# EAGLE design SWARMESH (EAGLE 9.2.0)
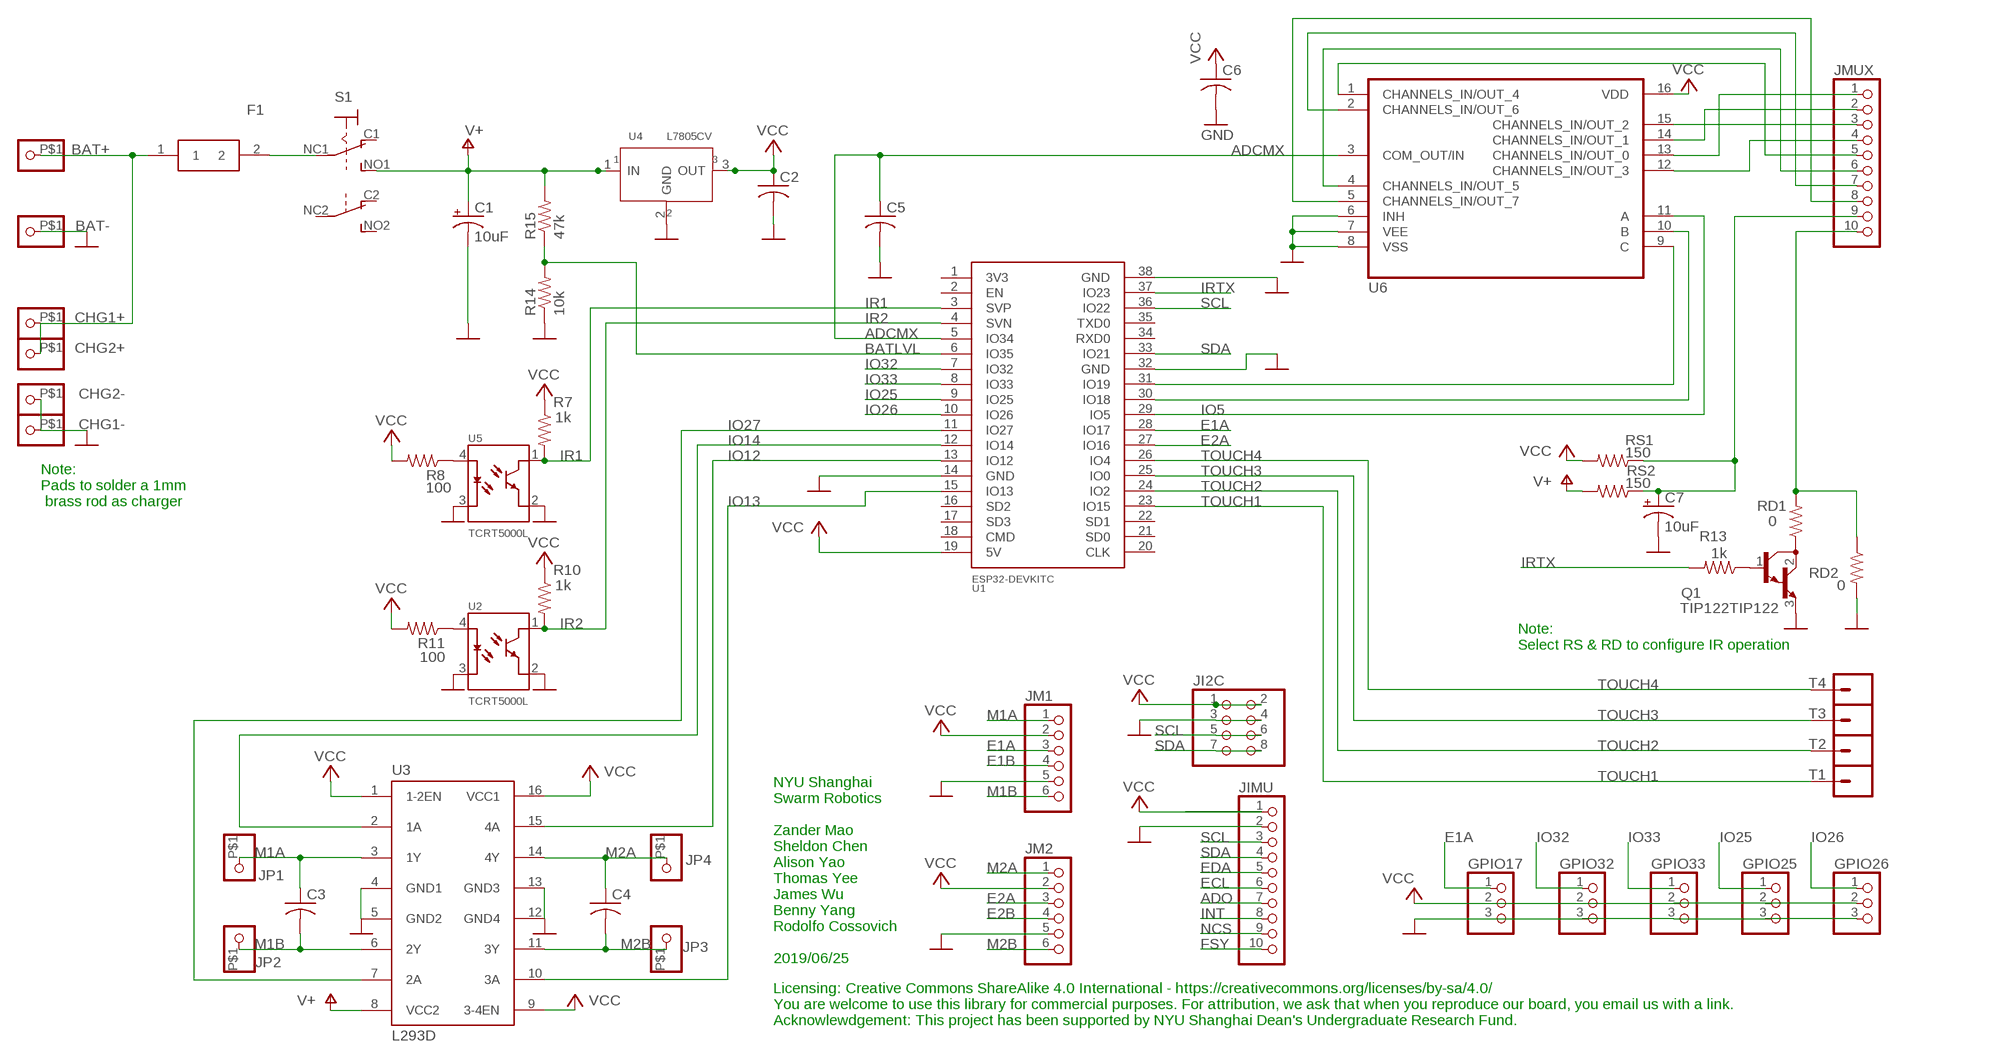
[diagram p0: schematic, sheet 1]

## Parts
BAT+  PINHD-1X1-BIGPOGO  [1X1-BIGPOGO]
BAT-  PINHD-1X1-BIGPOGO  [1X1-BIGPOGO]
C1  10uF  CPOL-USE2.5-7  [E2,5-7]
C2  C-USC0805  [C0805]
C3  C-USC0805  [C0805]
C4  C-USC0805  [C0805]
C5  C-USC0805  [C0805]
C6  C-USC0805  [C0805]
C7  10uF  CPOL-USE2.5-7  [E2,5-7]
CHG1+  PINHD-1X1-BIGPOGO  [1X1-BIGPOGO]
CHG1-  PINHD-1X1-BIGPOGO  [1X1-BIGPOGO]
CHG2+  PINHD-1X1-BIGPOGO  [1X1-BIGPOGO]
CHG2-  PINHD-1X1-BIGPOGO  [1X1-BIGPOGO]
F1  30R400UF  [30R400UF]
GPIO17  PINHD-1X3  [1X03]
GPIO25  PINHD-1X3  [1X03]
GPIO26  PINHD-1X3  [1X03]
GPIO32  PINHD-1X3  [1X03]
GPIO33  PINHD-1X3  [1X03]
JI2C  PINHD-2X4  [2X04]
JIMU  PINHD-1X10  [1X10-BIG]
JM1  PINHD-1X6  [1X06]
JM2  PINHD-1X6  [1X06]
JMUX  PINHD-1X10  [1X10-BIG]
JP1  PINHD-1X1-BIGPOGO  [1X1-BIGPOGO]
JP2  PINHD-1X1-BIGPOGO  [1X1-BIGPOGO]
JP3  PINHD-1X1-BIGPOGO  [1X1-BIGPOGO]
JP4  PINHD-1X1-BIGPOGO  [1X1-BIGPOGO]
Q1  TIP122TIP122  [TIP122MODIFIED]
R7  1k  R-US_M0805  [M0805]
R8  100  R-US_M0805  [M0805]
R10  1k  R-US_M0805  [M0805]
R11  100  R-US_M0805  [M0805]
R13  1k  R-US_M0805  [M0805]
R14  10k  R-US_M0805  [M0805]
R15  47k  R-US_M0805  [M0805]
RD1  0  R-US_M0805  [M0805]
RD2  0  R-US_M0805  [M0805]
RS1  150  R-US_M0805  [M0805]
RS2  150  R-US_M0805  [M0805]
S1  SWITCH_320-938  [PS22F03]
T1  CONN_01SPRING-CONN  [SPRING-CONNECTOR]
T2  CONN_01SPRING-CONN  [SPRING-CONNECTOR]
T3  CONN_01SPRING-CONN  [SPRING-CONNECTOR]
T4  CONN_01SPRING-CONN  [SPRING-CONNECTOR]
U1  ESP32DEVKITC  [ESP32-DEVKITC]
U2  TCRT5000L  [XDCR_TCRT5000L]
U3  L293D  [DIL16]
U4  L7805CV  [L7805CV_FOOTPRINT]
U5  TCRT5000L  [XDCR_TCRT5000L]
U6  CD4051BEE4  [CD4051BEE4DIP]

## Nets
ADCMX: C5.1 U1.5(IO34) U6.3(COM_OUT/IN)
ADO: JIMU.7
BATLVL: R14.2 R15.1 U1.6(IO35)
E1A: GPIO17.1 JM1.3 U1.28(IO17)
E1B: JM1.4
E2A: JM2.3 U1.27(IO16)
E2B: JM2.4
ECL: JIMU.6
EDA: JIMU.5
FSY: JIMU.10
GND: BAT-.P$1 C1.- C2.2 C5.2 C6.2 C7.- CHG1-.P$1 CHG2-.P$1 GPIO17.3 GPIO25.3 GPIO26.3 GPIO32.3 GPIO33.3 JI2C.3 JI2C.4 JIMU.2 JM1.5 JM2.5 Q1.3(E) R14.1 RD2.2 U1.14(GND) U1.32(GND) U1.38(GND) U2.2(E) U2.3(C) U3.4(GND1) U3.5(GND2) U3.12(GND4) U3.13(GND3) U4.2(GND) U5.2(E) U5.3(C)
INT: JIMU.8
IO5: U1.29(IO5) U6.11(A)
IO12: U1.13(IO12) U3.15(4A)
IO13: U1.15(IO13) U3.10(3A)
IO14: U1.12(IO14) U3.2(1A)
IO25: GPIO25.1 U1.9(IO25)
IO26: GPIO26.1 U1.10(IO26)
IO27: U1.11(IO27) U3.7(2A)
IO32: GPIO32.1 U1.7(IO32)
IO33: GPIO33.1 U1.8(IO33)
IR1: R7.2 U1.3(SVP) U5.1(CO)
IR2: R10.2 U1.4(SVN) U2.1(CO)
IRTX: R13.2 U1.37(IO23)
M1A: C3.1 JM1.1 JP1.P$1 U3.3(1Y)
M1B: C3.2 JM1.6 JP2.P$1 U3.6(2Y)
M2A: C4.1 JM2.1 JP4.P$1 U3.14(4Y)
M2B: C4.2 JM2.6 JP3.P$1 U3.11(3Y)
N$1: Q1.2(C) RD1.1
N$5: JMUX.6 U6.4(CHANNELS_IN/OUT_5)
N$7: U1.30(IO18) U6.10(B)
N$8: U1.31(IO19) U6.9(C)
N$9: R11.1 U2.4(A)
N$10: R8.1 U5.4(A)
N$11: JMUX.5 U6.1(CHANNELS_IN/OUT_4)
N$12: Q1.1(B) R13.1 U6.6(INH) U6.7(VEE) U6.8(VSS) ; supply symbol labelled GND
N$13: JMUX.7 U6.2(CHANNELS_IN/OUT_6)
N$14: JMUX.8 U6.5(CHANNELS_IN/OUT_7)
N$15: BAT+.P$1 CHG1+.P$1 CHG2+.P$1 F1.1
N$16: C7.+ JMUX.9 RS1.1 RS2.1
N$17: JMUX.10 RD1.2 RD2.1
N$18: F1.2 S1.NC1(1:P)
N$19: JMUX.1 U6.13(CHANNELS_IN/OUT_0)
N$20: JMUX.2 U6.14(CHANNELS_IN/OUT_1)
N$21: JMUX.4 U6.12(CHANNELS_IN/OUT_3)
N$22: JMUX.3 U6.15(CHANNELS_IN/OUT_2)
NCS: JIMU.9
SCL: JI2C.5 JI2C.6 JIMU.3 U1.36(IO22)
SDA: JI2C.7 JI2C.8 JIMU.4 U1.33(IO21)
TOUCH1: T1.P$2 U1.23(IO15)
TOUCH2: T2.P$2 U1.24(IO2)
TOUCH3: T3.P$2 U1.25(IO0)
TOUCH4: T4.P$2 U1.26(IO4)
V+: C1.+ R15.2 RS2.2 S1.NO1(1:S) U3.8(VCC2) U4.1(IN)
VCC: C2.1 C6.1 GPIO17.2 GPIO25.2 GPIO26.2 GPIO32.2 GPIO33.2 JI2C.1 JI2C.2 JIMU.1 JM1.2 JM2.2 R7.1 R8.2 R10.1 R11.2 RS1.2 U1.19(5V) U3.1(1-2EN) U3.9(3-4EN) U3.16(VCC1) U4.3(OUT) U6.16(VDD)
Unconnected: S1.C1(1:O) S1.C2(B:O) S1.NC2(B:P) S1.NO2(B:S) U1.1(3V3) U1.2(EN) U1.16(SD2) U1.17(SD3) U1.18(CMD) U1.20(CLK) U1.21(SD0) U1.22(SD1) U1.34(RXD0) U1.35(TXD0)

## Notes on the sheet
- Note:
  Pads to solder a 1mm
   brass rod as charger
- Note:
  Select RS & RD to configure IR operation
- NYU Shanghai
  Swarm Robotics
  
  Zander Mao
  Sheldon Chen
  Alison Yao
  Thomas Yee
  James Wu
  Benny Yang
  Rodolfo Cossovich
  
  2019/06/25
- Licensing: Creative Commons ShareAlike 4.0 International - https://creativecommons.org/licenses/by-sa/4.0/ 
  You are welcome to use this library for commercial purposes. For attribution, we ask that when you reproduce our board, you email us with a link.
  Acknowlewdgement: This project has been supported by NYU Shanghai Dean's Undergraduate Research Fund.

## Library data of the parts
BAT+ BAT- CHG1+ CHG1- CHG2+ CHG2- JP1-JP4 = adafruit:PINHD-1X1: Pin header 1x1 for 0.1" spacing With round pins
C1 C7 = adafruit:CPOL-US: POLARIZED CAPACITOR, American symbol
C2-C6 = adafruit:C-US: CAPACITOR, American symbol
F1 = 30R400UF:30R400UF: Littelfuse 4A Resettable Surface Fuse, 30V dc Source: Datasheet <http://m.littelfuse.com/~/media/electronics/datasheets/resettable_ptcs/littelfuse_ptc_30r_datasheet.pdf.pdf>; DESCRIPTION: Littelfuse 4A Resettable Surface Fuse, 30V dc; HEIGHT: 22mm; MANUFACTURER_NAME: LITTELFUSE; MANUFACTURER_PART_NUMBER: 30R400UF; MOUSER_PART_NUMBER: 576-30R400UF; MOUSER_PRICE-STOCK: https://www.mouser.com/Search/Refine.aspx?Keyword=576-30R400UF; RS_PART_NUMBER: 1740842; RS_PRICE-STOCK: http://uk.rs-online.com/web/p/products/1740842
GPIO17 GPIO25 GPIO26 GPIO32 GPIO33 = adafruit:PINHD-1X3: PIN HEADER
JI2C = adafruit:PINHD-2X4: PIN HEADER
JIMU JMUX = adafruit:PINHD-1X10: Pin header 1x10 0.1" spacing With round pins
JM1 JM2 = adafruit:PINHD-1X6: PIN HEADER
Q1 = TIP122(2):TIP122: NPN BIPOLAR DARLINGTON TRANSISTOR
R7 R8 R10 R11 R13-R15 RD1 RD2 RS1 RS2 = adafruit:R-US_: RESISTOR, American symbol
S1 = ArduinoNano LearningBot 4-21-18:SWITCH_320-938: TOGGLE SWITCH distributor RS Components
T1-T4 = SparkFun-Connectors:CONN_01: Single connection point. Often used as Generic Header-pin footprint for 0.1 inch spaced/style header connections On any of the 0.1 inch spaced packages, you can populate with these: Break Away Headers - Straight <https://www.sparkfun.com/products/116> (PRT-00116) Break Away Male Headers - Right Angle <https://www.sparkfun.com/products/553> (PRT-00553) Female Headers <https://www.sparkfun.com/products/115> (PRT-00115) Break Away Headers - Machine Pin <https://www.sparkfun.com/products/117> (PRT-00117) Break Away Female Headers - Swiss Machine Pin <https://www.sparkfun.com/products/743> (PRT-00743) This device is also useful as a general connection point to wire up your design to another part of your project. Our various solder wires solder well into these plated through hole pads. Hook-Up Wire - Assortment (Stranded, 22 AWG) <https://www.sparkfun.com/products/11375> (PRT-11375) Hook-Up Wire - Assortment (Solid Core, 22 AWG) <https://www.sparkfun.com/products/11367> (PRT-11367) View the entire wire category on our website here <https://www.sparkfun.com/categories/141> Special notes: SMTSO-256-ET is a "flush mount" nut for a 4-40 screw. We mostly use this on specialty testbeds; it is a nice way to connect hardware to your PCB at an adjustable hieght. Also note, the SNAP packages are for using a snappable style connector. We sell a baggie of snaps and they are also used on two LilyPad designs: Snap Assortment - 30 pack (male and female) <https://www.sparkfun.com/products/11347> (DEV-11347) LilyPad Arduino SimpleSnap <https://www.sparkfun.com/products/10941> (DEV-10941) LilyPad SimpleSnap Protoboard <https://www.sparkfun.com/products/10940> (DEV-10940); SF_ID: PRT-11822
U1 = ESP32-DEVKITC (1):ESP32DEVKITC
U2 U5 = TCRT5000L:TCRT5000L: TCRT5000 Series 940 nm 100 mA 60 mA Transistor Output Reflective Optical Sensor; AVAILABILITY: Unavailable; DESCRIPTION: TCRT5000 Series 940 nm 100 mA 60 mA Transistor Output Reflective Optical Sensor; MF: Vishay Semiconductor; MP: TCRT5000L; PACKAGE: PCB Mount Vishay; PRICE: None
U3 = st-microelectronics:L293D: PUSH-PULL 4 CHANNEL DRIVER; MPN: L293D; OC_FARNELL: 9589619; OC_NEWARK: 56P8249
U4 = L7805:L7805CV
U6 = CD4051BEE4:CD4051BEE4: Multiplexer 8pin ADC/DAC

## Board
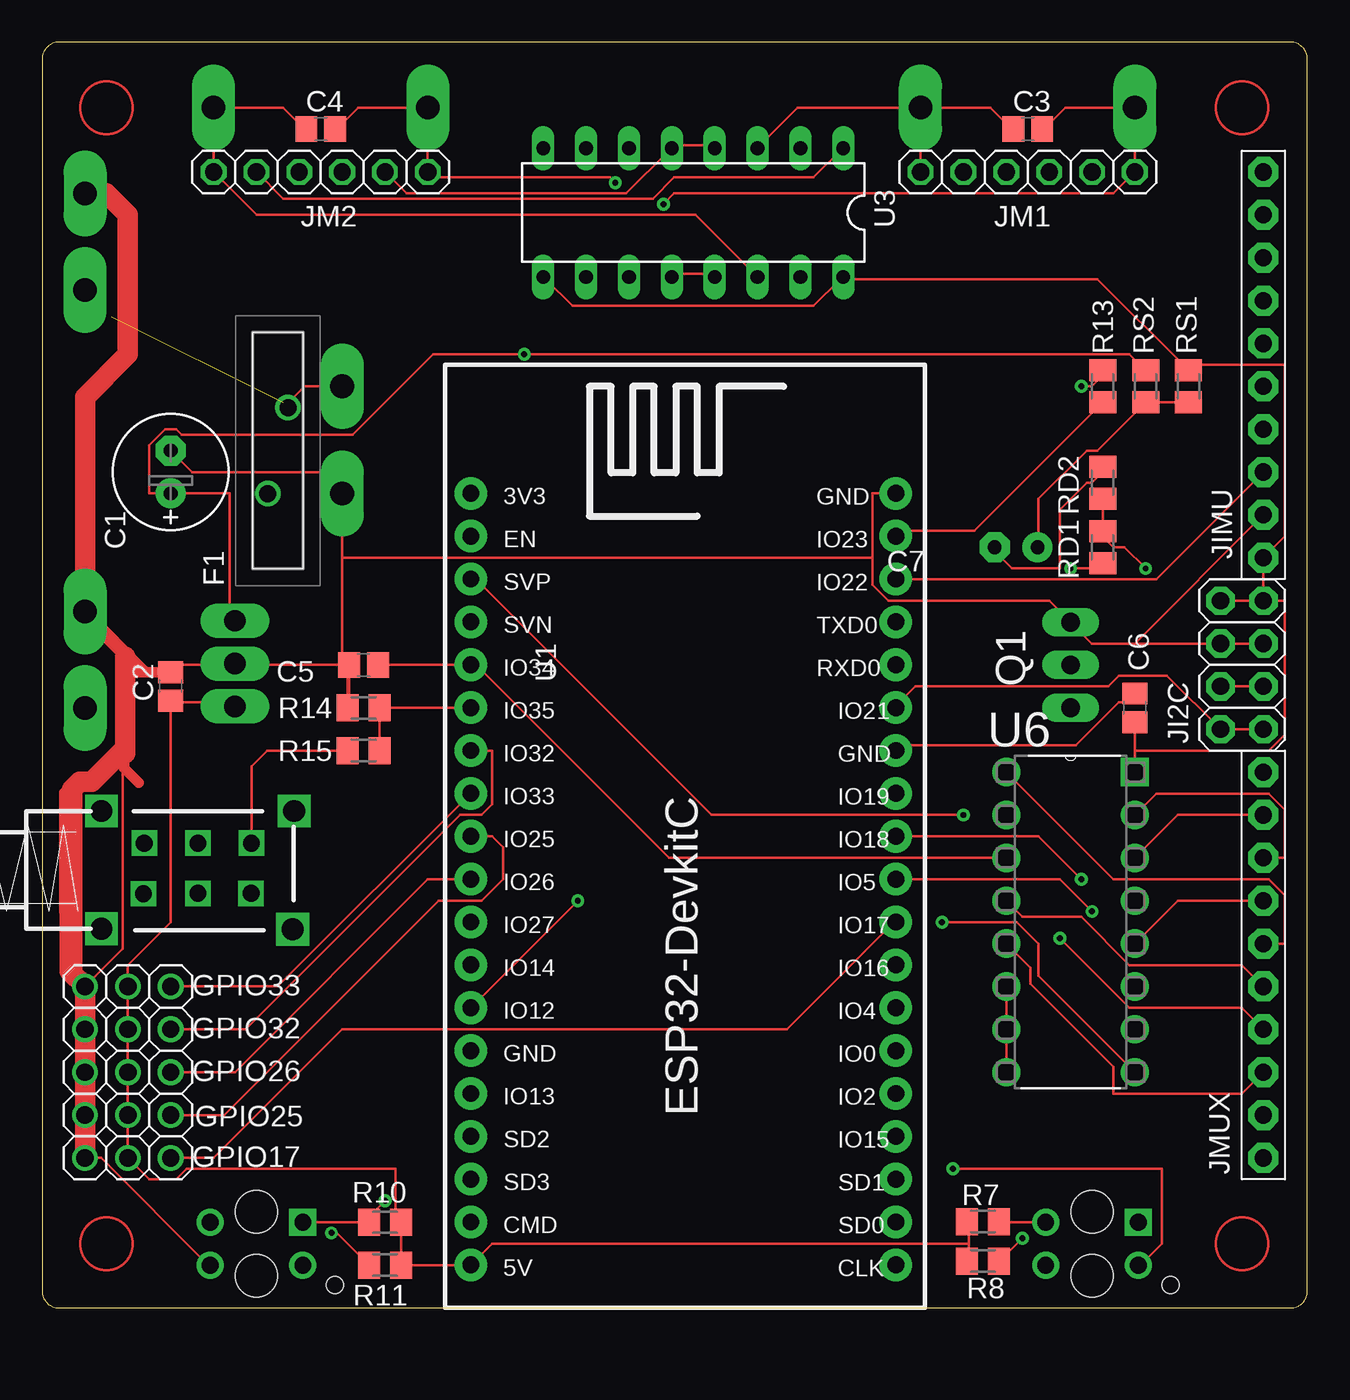
[diagram p1: board, top side]
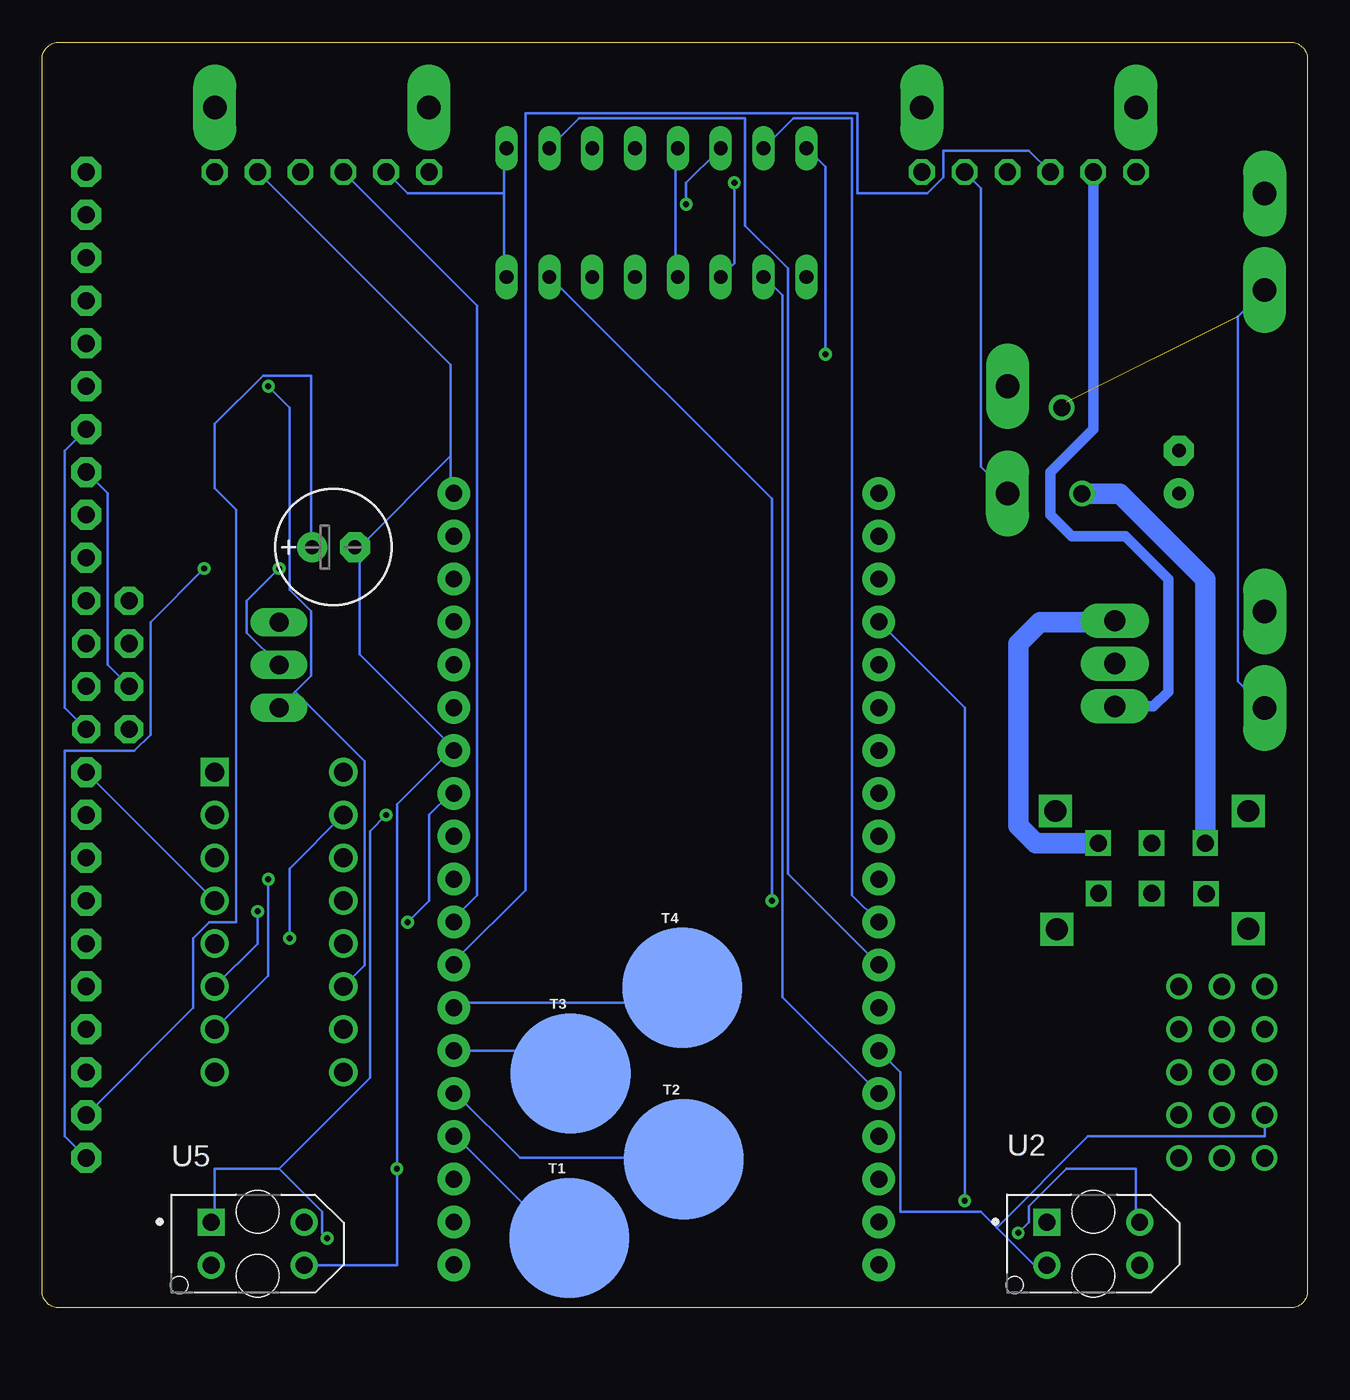
[diagram p2: board, bottom side, seen from below]

Size 75 x 75 mm. Coordinates in mm from the lower left corner, seen from the top.
Outline: 0,74 0,1 arc90 1,0 74,0 arc90 75,1 75,74 arc90 74,75 1,75 arc90 0,74
Copper layers (1*16): Top 0.035mm / dielectric 1.5mm / Bottom 0.035mm
Design rules "default *": minimum track width 6mil, minimum drill 0.35mm, track to track 6mil, track to pad 6mil, pad to pad 6mil, via to via 6mil, smd to smd 6mil, copper to edge 40mil, drill to drill 6mil, minimum pad ring 10mil, minimum via ring 8mil, stop-mask expansion 4mil, vias tented up to drill 0mil, thermal gap 10mil
tKeepout: area 0.9,0.9 to 6.7,6.7; area 68.3,1 to 74,6.6; area 0.9,68.2 to 6.7,74; area 68.2,68.2 to 74,74

### Footprints (pad centres in the part's own frame; a part is rotated, then mirrored left to right if it is on the bottom)
1X1-BIGPOGO = drill 1.4 pad 2.54 long: P$1 0,0
E2,5-7 = drill 0.813 pad 1.778: + -1.27,0 | drill 0.813 pad 1.778 octagon: - 1.27,0
C0805 = smd 1.3 x 1.5: 1 -0.85,0; 2 0.85,0
30R400UF = drill 1.01 pad 1.515: 1 -2.55,0.6; 2 2.55,-0.6
1X03 = drill 1.016: 1 -2.54,0; 2 0,0; 3 2.54,0
2X04 = drill 1.016 pad 1.676 octagon: 1 -3.81,-1.27; 2 -3.81,1.27; 3 -1.27,-1.27; 4 -1.27,1.27; 5 1.27,-1.27; 6 1.27,1.27; 7 3.81,-1.27; 8 3.81,1.27
1X10-BIG = drill 1.016 pad 1.778 octagon: 1 -11.43,0; 2 -8.89,0; 3 -6.35,0; 4 -3.81,0; 5 -1.27,0; 6 1.27,0; 7 3.81,0; 8 6.35,0; 9 8.89,0; 10 11.43,0
1X06 = drill 1.016 octagon: 1 -6.35,0; 2 -3.81,0; 3 -1.27,0; 4 1.27,0; 5 3.81,0; 6 6.35,0
TIP122MODIFIED = drill 1.118 long: 1 -2.54,0; 2 0,0; 3 2.54,0
M0805 = smd 1.3 x 1.6: 1 -0.95,0; 2 0.95,0
PS22F03 = drill 1.3 square: 0 -3.175,5.715; 1 3.835,5.613; 2 3.81,-5.715; 3 -3.175,-5.715 | drill 1 square: C1 -1.27,0; C2 1.702,0; NC1 -1.27,-3.175; NC2 1.727,-3.226; NO1 -1.27,3.175; NO2 1.702,3.15
SPRING-CONNECTOR = smd 7.112 x 7.112: P$2 0,0
ESP32-DEVKITC = drill 1 pad 1.93: 1 -0.01,0.01; 2 2.53,0.01; 3 5.07,0.01; 4 7.61,0.01; 5 10.15,0.01; 6 12.69,0.01; 7 15.23,0.01; 8 17.77,0.01; 9 20.31,0.01; 10 22.85,0.01; 11 25.39,0.01; 12 27.93,0.01; 13 30.47,0.01; 14 33.01,0.01; 15 35.55,0.01; 16 38.09,0.01; 17 40.63,0.01; 18 43.17,0.01; 19 45.71,0.01; 20 45.71,25.2; 21 43.17,25.2; 22 40.63,25.2; 23 38.09,25.2; 24 35.55,25.2; 25 33.01,25.2; 26 30.47,25.2; 27 27.93,25.2; 28 25.39,25.2; 29 22.85,25.2; 30 20.31,25.2; 31 17.77,25.2; 32 15.23,25.2; 33 12.69,25.2; 34 10.15,25.2; 35 7.61,25.2; 36 5.07,25.2; 37 2.53,25.2; 38 -0.01,25.2
XDCR_TCRT5000L = drill 1 pad 1.6 square: 1 -2.75,1.27 | drill 1 pad 1.6: 2 -2.75,-1.27; 3 2.75,-1.27; 4 2.75,1.27 | hole 2.5: 0,1.9; 0,-1.9 | hole 1: -4.65,-2.45
DIL16 = drill 0.813 long: 1 -8.89,-3.81; 2 -6.35,-3.81; 3 -3.81,-3.81; 4 -1.27,-3.81; 5 1.27,-3.81; 6 3.81,-3.81; 7 6.35,-3.81; 8 8.89,-3.81; 9 8.89,3.81; 10 6.35,3.81; 11 3.81,3.81; 12 1.27,3.81; 13 -1.27,3.81; 14 -3.81,3.81; 15 -6.35,3.81; 16 -8.89,3.81
L7805CV_FOOTPRINT = drill 1.27 pad 2.032 long: 1 -2.54,0; 2 0,0; 3 2.54,0
CD4051BEE4DIP = drill 1.118: 1 -3.81,8.89; 2 -3.81,6.35; 3 -3.81,3.81; 4 -3.81,1.27; 5 -3.81,-1.27; 6 -3.81,-3.81; 7 -3.81,-6.35; 8 -3.81,-8.89; 9 3.81,-8.89; 10 3.81,-6.35; 11 3.81,-3.81; 12 3.81,-1.27; 13 3.81,1.27; 14 3.81,3.81; 15 3.81,6.35 | drill 1.118 square: 16 3.81,8.89

### Placement (x,y rotation side)
BAT+  2.54,60.33 90 top
BAT-  17.78,48.26 90 top
C1  7.62,49.53 90 top
C2  7.62,36.83 90 top
C3  58.42,69.85 0 top
C4  16.51,69.85 0 top
C5  19.05,38.1 180 top
C6  64.77,35.56 90 top
C7  57.73,45.08 0 bottom
CHG1+  2.54,35.56 270 top
CHG1-  2.54,41.27 270 top
CHG2+  17.78,54.61 270 bottom
CHG2-  2.54,66.04 270 top
F1  13.97,50.8 270 top
GPIO17  5.08,8.89 180 top
GPIO25  5.08,11.43 180 top
GPIO26  5.08,13.97 180 top
GPIO32  5.08,16.51 180 top
GPIO33  5.08,19.05 180 top
JI2C  71.12,38.1 270 top
JIMU  72.39,55.88 90 top
JM1  58.42,67.31 0 top
JM2  16.51,67.31 0 top
JMUX  72.39,20.32 270 top
JP1  52.07,71.12 90 top
JP2  64.77,71.12 90 top
JP3  22.86,71.12 270 top
JP4  10.16,71.12 90 top
Q1  60.96,38.1 90 top
R7  55.77,2.77 0 top
R8  55.77,5.12 180 top
R10  20.32,5.08 180 top
R11  20.32,2.54 0 top
R13  62.87,54.61 270 top
R14  19.05,35.56 0 top
R15  19.05,33.02 180 top
RD1  62.87,45.09 90 top
RD2  62.87,48.9 90 top
RS1  67.94,54.61 90 top
RS2  65.41,54.61 90 top
S1  9.23,26.27 270 top
T1  43.76,4.16 0 bottom
T2  36.97,8.81 0 bottom
T3  43.69,13.89 0 bottom
T4  37.06,18.98 0 bottom
U1  25.4,48.26 270 top
U2  12.7,3.81 0 bottom
U3  38.59,64.9 180 top
U4  11.42,38.18 270 bottom
U5  62.23,3.81 0 bottom
U6  60.96,22.86 0 top

### Tracks (layer width: path | path; a pad name or v marks a point on that pad's centre or on a via)
ADCMX
  Top 0.152: C5.1 U1.5 25.72,38.1 37.15,26.67 U6.3
BATLVL
  Top 0.152: R14.2 R15.1 | R14.2 U1.6 | R14.2
E1A
  Top 0.152: U1.28 50.48,22.86 44.13,16.51 17.78,16.51 10.16,8.89 GPIO17.1
  Bottom 0.152: JM1.3 49.21,59.37 49.21,24.45 50.48,23.18 U1.28
E2A
  Bottom 0.152: JM2.3 16.51,68.58 21.59,68.58 21.59,66.99 22.54,66.04 26.67,66.04 26.67,70.8 46.35,70.8 46.35,24.77 50.48,20.64 U1.27
GND  (via drill 0.35)
  Top 0.152: C6.2 64.77,36.2 64.45,35.88 63.82,35.88 61.28,33.34 50.8,33.34 U1.32 | v53.98,8.26 66.36,8.26 66.36,3.81 65.09,2.54 U5.2 | JI2C.4 JI2C.3 64.77,39.37 | 64.77,39.37 62.23,39.37 Q1.3 59.69,41.91 50.16,41.91 49.21,42.86 49.21,44.45 | 64.77,39.37 JIMU.2 | RD2.2 62.87,49.53 62.23,48.9 61.91,48.9 60.33,47.31 60.33,43.81 57.47,43.81 56.52,44.77 C7.- | 49.21,44.45 49.21,48.26 50.48,48.26 U1.38 | U2.3 9.84,2.54 3.49,8.89 GPIO17.3 GPIO25.3 GPIO26.3 GPIO32.3 GPIO33.3 4.76,21.27 4.76,33.02 4.76,37.78 | U3.12 37.47,61.28 39.69,61.28 U3.13 | U3.4 39.69,68.9 37.47,68.9 U3.5 37.15,68.58 34.61,66.04 21.59,66.04 JM2.5 | 7.62,37.78 7.94,38.1 11.11,38.1 U4.2 11.43,38.1 17.78,38.1 | CHG1-.P$1 4.76,39.05 4.76,37.78 | 7.62,37.78 5.71,37.78 4.76,37.78 | 7.62,37.78 C2.2 | C1.- 8.89,49.53 16.51,49.53 BAT-.P$1 17.78,44.45 | 17.78,44.45 17.78,38.1 | 18.1,38.1 C5.2 | 17.78,44.45 49.21,44.45 | 17.78,38.1 18.1,37.78 R14.1 18.2,35.66 C5.2 | C5.2 17.78,38.1
  Top 0.61: 5.71,37.78 4.92,38.58 2.54,40.96 CHG1-.P$1 6.13,37.68 | 6.13,37.68 4.87,37.68 4.87,31.96 5.71,31.11 | 6.13,37.68 C2.2 | 4.92,32.86 3.17,31.11 1.91,31.11 1.32,30.53 1.32,23.5
  Top 1.219: GPIO17.3 GPIO33.3 1.63,19.96 | 1.63,19.96 1.63,23.5 | 1.63,19.96 1.78,20.12 1.78,30.74 2.22,31.18 2.92,31.18 4.76,33.02 | 4.92,32.86 4.92,38.58 | CHG1-.P$1 2.54,53.98 5.08,56.52 5.08,64.77 3.81,66.04 CHG2-.P$1
  Bottom 0.152: U5.3 53.98,2.54 v53.98,8.26 53.98,29.84 50.8,33.02 U1.32 50.8,33.34 56.2,38.73 56.2,44.77 C7.- 56.2,45.09 50.8,50.48 | JM1.5 50.8,55.88 50.8,50.48 | 50.8,50.48 50.8,48.58 U1.38 | U2.2 16.19,2.54 18.41,4.76 | 18.41,4.76 19.37,5.71 24.13,5.71 24.13,13.97 U1.14 | 18.41,4.76 13.02,10.16 2.54,10.16 GPIO25.3 | U3.12 37.47,61.28 37.47,68.58 U3.5 | JM2.5 19.37,66.36 19.37,49.85 BAT-.P$1
IO5  (via drill 0.35)
  Top 0.152: v62.23,23.5 60.33,25.4 50.8,25.4 U1.29
  Bottom 0.152: U6.11 62.23,21.59 v62.23,23.5
IO12  (via drill 0.35)
  Top 0.152: U1.13 v31.75,24.13
  Bottom 0.152: v31.75,24.13 31.75,47.94 44.77,60.96 U3.15
IO13
  Bottom 0.152: U1.15 31.11,18.41 31.11,60.01 32.07,60.96 U3.10
IO14
  Bottom 0.152: U1.12 30.8,25.72 30.8,61.59 33.34,64.14 33.34,70.48 43.18,70.48 44.77,68.9 U3.2
IO25
  Top 0.152: U1.9 26.67,27.94 27.3,27.3 27.3,25.4 26.04,24.13 23.5,24.13 10.79,11.43 GPIO25.1
IO26
  Top 0.152: U1.10 22.86,25.4 11.43,13.97 GPIO26.1
IO27
  Bottom 0.152: U1.11 26.99,24.45 26.99,70.48 30.48,70.48 32.07,68.9 U3.7
IO32
  Top 0.152: U1.7 25.72,33.02 26.67,33.02 26.67,29.84 26.04,29.21 24.77,29.21 12.06,16.51 GPIO32.1
IO33
  Top 0.152: GPIO33.1 13.97,19.05 U1.8
IR1  (via drill 0.35)
  Top 0.152: v58.1,4.13 56.83,2.86 R7.2 | v54.61,29.21 39.69,29.21 25.72,43.18 U1.3
  Bottom 0.152: v58.1,4.13 58.42,4.45 58.42,5.71 60.96,8.26 | 60.96,8.26 64.77,8.26 64.77,5.08 U5.1 | v54.61,29.21 55.56,28.26 55.56,13.65 60.96,8.26
IR2  (via drill 0.35)
  Top 0.152: U2.1 19.05,5.08 | 19.05,5.08 R10.2 | 19.05,5.08 v20.32,6.35
  Bottom 0.152: U1.4 20.32,35.56 v20.32,6.35
IRTX
  Top 0.152: R13.2 55.24,46.04 50.8,46.04 U1.37
M1A
  Top 0.152: JP1.P$1 56.2,71.12 57.47,69.85 C3.1 | JP1.P$1 44.77,71.12 42.55,68.9 U3.3 | JP1.P$1 JM1.1
M1B  (via drill 0.35)
  Top 0.152: C3.2 59.37,69.85 60.64,71.12 JP2.P$1 JM1.6 63.5,66.04 37.47,66.04 v36.83,65.41
  Bottom 0.152: v36.83,65.41 36.83,66.67 34.92,68.58 U3.6
M2A
  Top 0.152: C4.1 15.56,69.85 14.29,71.12 JP4.P$1 JM2.1 12.7,64.77 38.73,64.77 42.23,61.28 U3.14
M2B  (via drill 0.35)
  Top 0.152: C4.2 17.46,69.85 18.73,71.12 JP3.P$1 JM2.6 23.18,66.99 33.66,66.99 v33.97,66.67
  Bottom 0.152: v33.97,66.67 33.97,61.91 34.61,61.28 U3.11
N$1  (via drill 0.35)
  Top 0.152: v60.96,43.81 62.87,43.81 RD1.1
  Bottom 0.152: Q1.2 62.87,40.01 62.87,41.91 v60.96,43.81
N$5
  Top 0.152: U6.4 58.1,23.18 61.59,23.18 64.45,20.32 71.12,20.32 JMUX.6
N$7  (via drill 0.35)
  Top 0.152: v61.59,25.4 59.05,27.94 50.8,27.94 U1.30
  Bottom 0.152: U6.10 61.59,19.68 v61.59,25.4
N$8  (via drill 0.35)
  Top 0.152: v53.34,22.86 57.78,22.86 59.05,21.59 59.05,19.68 U6.9
  Bottom 0.152: v53.34,22.86 52.07,24.13 52.07,29.21 50.8,30.48 U1.31
N$9  (via drill 0.35)
  Top 0.152: v17.14,4.45 17.46,4.45 R11.1
  Bottom 0.152: v17.14,4.45 16.51,5.08 16.51,6.03 14.29,8.26 10.16,8.26 10.16,5.08 U2.4
N$10
  Top 0.152: U5.4 56.83,5.08 R8.1
N$11
  Top 0.152: U6.1 63.5,25.4 72.71,25.4 73.66,24.45 73.66,21.59 JMUX.5
N$12  (via drill 0.35)
  Top 0.152: U6.8 U6.7 U6.6 | v61.59,54.61 62.23,54.61 62.87,55.24 R13.1
  Bottom 0.152: v61.59,54.61 60.33,53.34 60.33,42.55 59.05,41.27 59.05,37.47 60.01,36.51 | Q1.1 60.01,36.51 | U6.6 55.88,20.32 55.88,32.38 60.01,36.51
N$13  (via drill 0.35)
  Top 0.152: v60.33,21.91 64.45,17.78 71.12,17.78 JMUX.7
  Bottom 0.152: U6.2 60.33,26.04 v60.33,21.91
N$14
  Top 0.152: JMUX.8 71.12,12.7 63.5,12.7 63.5,14.29 58.58,19.21 58.58,20.16 U6.5
N$15  (1 unrouted)
  Top 0.152: CHG2+.P$1 15.56,54.61 14.61,53.66 F1.1 14.29,53.66
  Bottom 0.152: CHG1+.P$1 4.13,37.15 4.13,58.74 BAT+.P$1
N$16
  Top 0.152: RS2.1 RS1.1 | RS2.1 62.55,50.8 61.91,50.8 59.05,47.94 59.05,45.09 C7.+ | RS2.1
  Bottom 0.152: JMUX.9 66.04,17.78 66.04,21.91 65.09,22.86 63.5,22.86 63.5,47.31 64.77,48.58 64.77,52.39 61.91,55.24 59.05,55.24 59.05,45.09 C7.+
N$17  (via drill 0.35)
  Top 0.152: RD2.1 RD1.2 62.87,45.72 63.5,45.09 64.14,45.09 v65.41,43.81
  Bottom 0.152: v65.41,43.81 68.58,40.64 68.58,33.97 69.53,33.02 73.66,33.02 73.66,10.16 JMUX.10
N$18
  Bottom 1.219: F1.2 11.12,48.25 6.05,43.18 S1.NC1
N$19
  Bottom 0.152: JMUX.1 U6.13
N$20
  Top 0.152: U6.14 67.31,29.21 JMUX.2
N$21
  Top 0.152: U6.12 67.31,24.13 JMUX.4
N$22
  Top 0.152: U6.15 66.04,30.48 72.71,30.48 73.66,29.53 73.66,26.67 JMUX.3
SCL
  Top 0.152: JI2C.6 JI2C.5 | JIMU.3 66.04,43.18 50.8,43.18 U1.36
  Bottom 0.152: JIMU.3 71.12,48.26 71.12,38.1 JI2C.5
SDA
  Top 0.152: JI2C.8 JI2C.7 66.67,37.47 63.82,37.47 63.18,36.83 51.75,36.83 50.8,35.88 U1.33
  Bottom 0.152: JIMU.4 73.66,50.8 73.66,35.56 JI2C.8
TOUCH1
  Bottom 0.152: U1.23 50.48,10.16 44.77,4.45 43.81,4.45 T1.P$2
TOUCH2
  Bottom 0.152: U1.24 50.48,12.7 46.67,8.89 37.15,8.89 T2.P$2
TOUCH3
  Bottom 0.152: U1.25 50.48,15.24 43.81,15.24 43.81,13.97 T3.P$2
TOUCH4
  Bottom 0.152: U1.26 50.48,18.1 37.15,18.1 37.15,18.73 T4.P$2
V+  (via drill 0.35)
  Top 0.152: RS2.2 64.45,56.52 v28.57,56.52 23.18,56.52 18.41,51.75 8.26,51.75 7.94,52.07 7.3,52.07 6.35,51.12 6.35,48.26 C1.+ 11.11,48.26 11.11,40.96 U4.1 | R15.2 13.34,33.02 12.4,32.09 S1.NO1
  Bottom 0.152: v28.57,56.52 28.57,67.63 29.53,68.58 U3.8
  Bottom 0.61: U4.1 11.51,40.64
  Bottom 1.219: S1.NO1 16.11,27.54 17.14,28.57 17.14,39.37 15.88,40.64 11.51,40.64
VCC
  Top 0.152: R11.2 R10.1 20.95,5.08 20.95,8.26 8.57,8.26 7.94,7.62 6.35,7.62 GPIO17.2 GPIO25.2 GPIO26.2 GPIO32.2 GPIO33.2 5.08,20.32 7.62,22.86 7.62,35.88 | 54.93,3.81 54.93,5.08 R8.2 | 54.93,3.81 54.93,2.86 R7.1 | 54.93,3.81 26.67,3.81 U1.19 R11.2 | R11.2 | 7.62,35.88 11.11,35.88 U4.3 | 7.62,35.88 C2.1 | U6.16 64.77,33.02 | 64.77,33.02 C6.1 | JI2C.2 JI2C.1 | JI2C.2 JIMU.1 73.66,45.72 73.66,55.88 67.63,55.88 | 64.77,33.02 72.71,33.02 73.66,33.97 73.66,41.91 JI2C.2 | 67.63,55.88 62.55,60.96 47.62,60.96 U3.16 47.31,60.96 45.72,59.37 31.43,59.37 29.84,60.96 U3.9 | 67.63,55.88 RS1.2 67.63,55.88 | JM2.2 14.29,65.72 36.2,65.72 37.47,66.99 45.72,66.99 47.31,68.58 U3.1
  Bottom 0.152: 47.62,66.04 47.62,61.28 U3.16 | 47.62,66.04 47.62,68.58 U3.1 | JM1.2 53.34,66.04 47.62,66.04
  Bottom 0.61: JM2.2 12.7,52.07 15.24,49.53 15.24,46.99 13.97,45.72 10.79,45.72 8.26,43.18 8.26,36.51 9.13,35.64 U4.3
(copper drawn outside any net)
  shapes: Top circle x4

### Text on the board
Document: NYU Shanghai / Swarm Robotics / / Zander Mao / Sheldon Chen / Alison Yao / Thomas Yee / James Wu / Benny Yang / Rodolfo Cossovich / / 2019/06/25 | Licensing: Creative Commons ShareAlike 4.0 International - https://creativecommons.org/licenses/by-sa/4.0/ / You are welcome to use this library for commercial purposes. For attribution, we ask that when you reproduce our board, you email us with a link. / Acknowlewdgement: This project has been supported by NYU Shanghai Dean's Undergraduate Research Fund. | Notes: tip122 and 7805 have no component body. / designators have different font size and are not aligned. / Switch designator missing. It seems that many footprints overlap silkscreen to solder pads. / Pin 1 should be indicated in any connector. Touch pads are too big and could have a hole to solder a cable. / Positive and negative pads for battery look the same (they should have slikscreen marks and different shape) / confirm if we can pass through holes of TCRT5000 / S1 has the wrong footprint (it's the middle contact the one that connects / battery pads can be moved around for better ground